# Altium schematic sheet Power.SchDoc
size A4
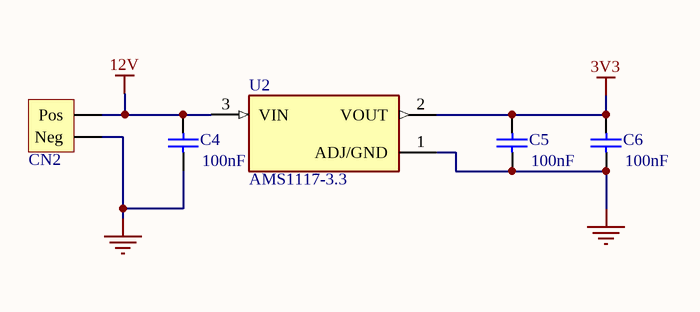
[diagram p0: Power.SchDoc]

## Parts
C4  value 100nF  [0402]  (hidden comment: Cap)
C5  value 100nF  [0402]  (hidden comment: Cap)
C6  value 100nF  [0402]  (hidden comment: Cap)
CN2  JST_Leads_In  [Power_Leads]  (value not drawn)
U2  AMS1117-3.3  [SOT229P700X180-4N]

## Nets
3V3: C5.2 C6.2 U2.2(VOUT)
12V: C4.2 CN2.A(Pos) U2.3(VIN)
GND: C4.1 C5.1 C6.1 CN2.K(Neg) U2.1(ADJ/GND)

## Library data of the parts
U2 = AMS1117-3.3: Sot223/Pkg 1-Amp 3.3-Volt Low Drop Out Voltage Regulatator; MF: Advanced Monolithic Systems; Price: None; Package: None; Value: *; MP: AMS1117-3.3; Availability: Unavailable; SnapEDA_Link: https://www.snapeda.com/parts/AMS1117-3.3/Advanced%20Monolithic%20Systems/view-part/53450/?ref=snap
C4-C6 = Cap: Published: 8-Jun-2000; LatestRevisionDate: 17-Jul-2002; LatestRevisionNote: Re-released for DXP Platform.; PackageReference: RAD-0.3; Publisher: Altium Limited; PackageDescription: Radial Cap, Thru-Hole; 2 Leads; 0.3 in Pin Spacing